# Altium schematic sheet IMP.SchDoc
size A4
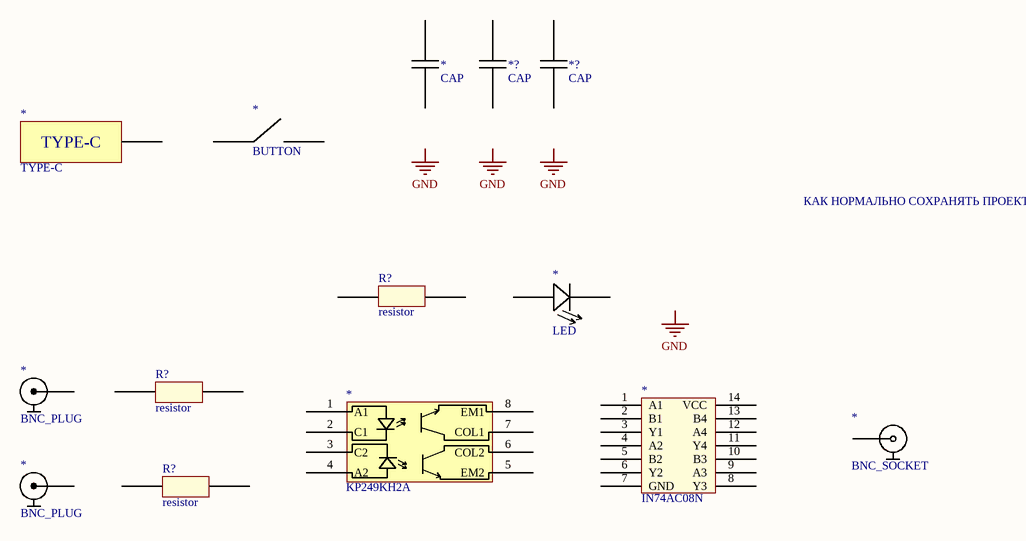
[diagram p0: IMP.SchDoc]

## Parts
(Parts that share a designator on the sheet are numbered #1, #2 ... from top to bottom, then left to right.)
*#1  CAP
*#2  BUTTON
*#3  TYPE-C
*#4  LED
*#5  BNC_PLUG
*#6  IN74AC08N
*#7  KP249KH2A
*#8  BNC_SOCKET
*#9  BNC_PLUG
*?#1  CAP
*?#2  CAP
R?#1  resistor  [RES]
R?#2  resistor  [RES]
R?#3  resistor  [RES]

## Nets

Not connected (* = marked no-connect by the designer): *#1 1 2; *#2 1 2; *#3 1; *#4 1 2; *#5 1; *#6 1(A1) 2(B1) 3(Y1) 4(A2) 5(B2) 6(Y2) 7(GND) 8(Y3) 9(A3) 10(B3) 11(Y4) 12(A4) 13(B4) 14(VCC); *#7 1(A1) 2(C1) 3(C2) 4(A2) 5(EM2) 6(COL2) 7(COL1) 8(EM1); *#9 1; *?#1 1 2; *?#2 1 2; R?#1 1 2; R?#2 1 2; R?#3 1 2

## Notes on the sheet
- КАК НОРМАЛЬНО СОХРАНЯТЬ ПРОЕКТ
- Labels drawn without touching a wire or pin: GND

## Library data of the parts
R?#1-R?#3 = RES